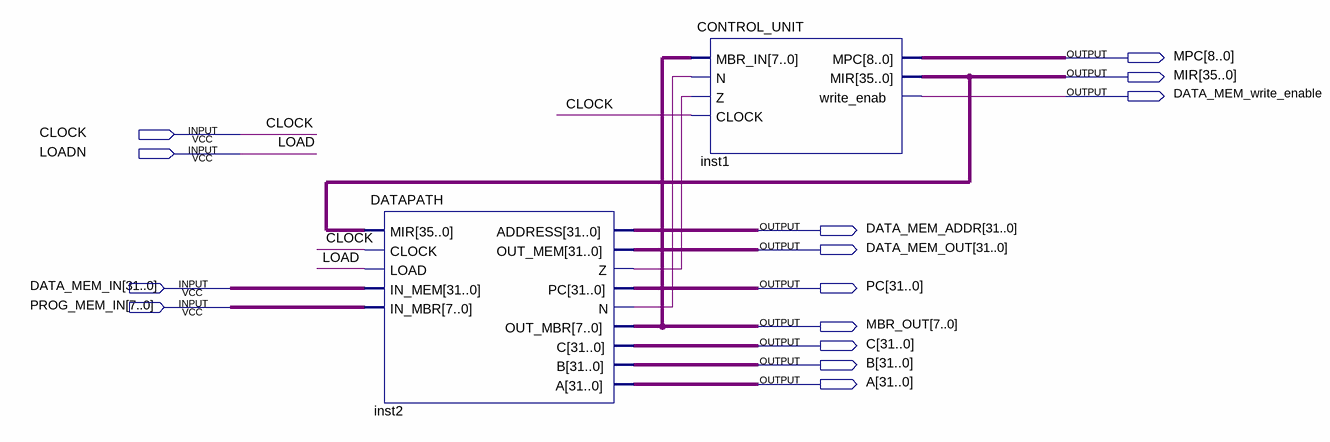
[diagram p0: schematic sheet]
// Quartus schematic CPU.bdf as structural Verilog: 2 symbols, 14 pins
module CPU (
  input  CLOCK,
  input  LOADN,
  input  [31:0] DATA_MEM_IN,
  input  [7:0] PROG_MEM_IN,
  output [8:0] MPC,
  output [35:0] MIR,
  output DATA_MEM_write_enable,
  output [31:0] DATA_MEM_ADDR,
  output [31:0] DATA_MEM_OUT,
  output [31:0] PC,
  output [7:0] MBR_OUT,
  output [31:0] C,
  output [31:0] B,
  output [31:0] A
);

  wire inst2_n, inst2_z;

  DATAPATH inst2 (
    .MIR(MIR), .CLOCK(CLOCK), .LOAD(LOADN), .IN_MEM(DATA_MEM_IN), .IN_MBR(PROG_MEM_IN),
    .ADDRESS(DATA_MEM_ADDR), .OUT_MEM(DATA_MEM_OUT), .Z(inst2_z), .PC(PC), .N(inst2_n), .OUT_MBR(MBR_OUT),
    .C(C), .B(B), .A(A));
  CONTROL_UNIT inst1 (
    .MBR_IN(MBR_OUT), .N(inst2_n), .Z(inst2_z), .CLOCK(CLOCK), .MPC(MPC), .MIR(MIR),
    .write_enab(DATA_MEM_write_enable));

  // Other names for the same wires on the sheet: LOAD = LOADN
endmodule
